# Altium project FC_Ver0.PrjPcb
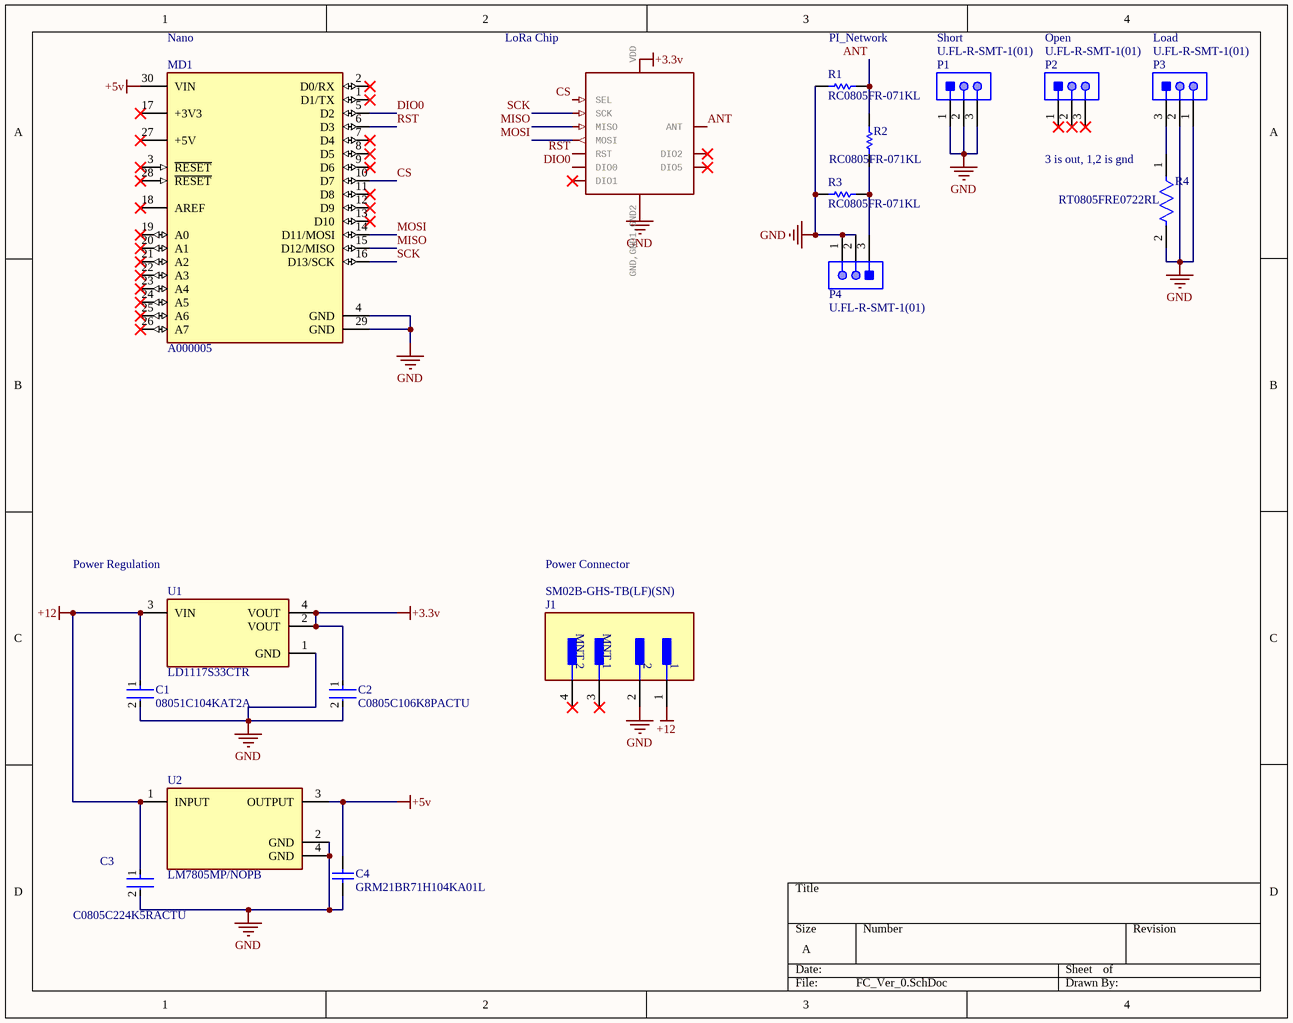
[diagram p0: FC_Ver_0.SchDoc]
1 sheet, 17 parts. Net scope: global (net labels, ports and power ports of the same name join across sheets).
Board file: FC_Ver_0.PcbDoc

## Sheet FC_Ver_0.SchDoc
size A; SheetNumber: 1; SheetTotal: 1

### Parts
1  _C2H_RFM95  [_C2H_RFM95]  (value not drawn)
C1  08051C104KAT2A  [FP-0805-L_2_01_0_2-W_1_25-IPC_B]
C2  C0805C106K8PACTU  [FP-C0805C-DG-MFG]
C3  C0805C224K5RACTU  [FP-C0805C-DN-MFG]
C4  GRM21BR71H104KA01L  [CAPC2013X135X45ML10T25]
J1  SM02B-GHS-TB(LF)(SN)  [FP-SM02B-GHS-TB_LF_SN-MFG]
MD1  A000005  [FP-A000005-MFG]
P1  U.FL-R-SMT-1(01)  [HRS-U.FL-R-SMT-3_V]
P2  U.FL-R-SMT-1(01)  [HRS-U.FL-R-SMT-3_V]
P3  U.FL-R-SMT-1(01)  [HRS-U.FL-R-SMT-3_V]
P4  U.FL-R-SMT-1(01)  [HRS-U.FL-R-SMT-3_V]
R1  RC0805FR-071KL  [RESC2013X60X35ML10T20]
R2  RC0805FR-071KL  [RESC2013X60X35ML10T20]
R3  RC0805FR-071KL  [RESC2013X60X35ML10T20]
R4  RT0805FRE0722RL  [FP-RT0805-MFG]
U1  LD1117S33CTR  [FP-SOT-223-0046067_14-MFG]
U2  LM7805MP/NOPB  [FP-DCY0004A-MFG]

### Nets
+3.3v: 1.VDD(VCC) C2.1 U1.2(VOUT) U1.4(VOUT)
+5v: C4.1 MD1.30(VIN) U2.3(OUTPUT)
+12: C1.1 C3.1 J1.1 U1.3(VIN) U2.1(INPUT)
GND: 1.GND,GND1,GND2(GND) C1.2 C2.2 C3.2 C4.2 J1.2 MD1.4(GND) MD1.29(GND) P1.1 P1.2 P1.3 P3.1 P3.2 P4.1 P4.2 R1.2 R3.1 R4.2 U1.1(GND) U2.2(GND) U2.4(GND)
ANT: 1.ANT R1.1 R2.2
CS: 1.NSS(SEL) MD1.10(D7)
DIO0: 1.DIO0 MD1.5(D2)
MISO: 1.MISO MD1.15(D12/MISO)
MOSI: 1.MOSI MD1.14(D11/MOSI)
RST: 1.RST MD1.6(D3)
SCK: 1.SCK MD1.16(D13/SCK)
NetP3_3: P3.3 R4.1
NetP4_3: P4.3 R2.1 R3.2

Not connected (* = marked no-connect by the designer): 1 DIO1* DIO2* DIO5*; J1 3(MNT_1)* 4(MNT_2)*; MD1 1(D1/TX)* 2(D0/RX)* 3(~{RESET})* 7(D4)* 8(D5)* 9(D6)* 11(D8)* 12(D9)* 13(D10)* 17(+3V3)* 18(AREF)* 19(A0)* 20(A1)* 21(A2)* 22(A3)* 23(A4)* 24(A5)* 25(A6)* 26(A7)* 27(+5V)* 28(~{RESET})*; P2 1* 2* 3*

### Notes on the sheet
- (near MD1) Nano
- (near 1) LoRa Chip
- (near R1) PI_Network
- Short
- Open
- Load
- (near R4) 3 is out, 1,2 is gnd
- (near U1) Power Regulation
- Power Connector

### Library data of the parts
1 = _C2H_RFM95: GateName_1: G$1; SymbolName_1: _C2H_RFM95; LibraryName: AmbaSat-1v1-01-NO-solar; DeviceSetName: _C2H_RFM95; Package: _C2H_RFM95
C1 = CMP-2007-04174-2: General Purpose Ceramic Capacitor, 0805, 100nF, 10%, X7R, 15%, 100V; Packaging: Tape and Reel; Min Operating Temperature: -55°C; Dielectric Material: Ceramic; Height: 1.4mm; Voltage Rating: 100V; Termination: SMD/SMT; Case Code (Imperial): 0805; Case Code (Metric): 2012; Case/Package: 0805; Construction: Flat; Radiation Hardening: No; Series: -; Dielectric: X7R; Package Quantity: 2000; Mount: Surface Mount; Capacitance: 100nF; Contact Plating: Tin; Voltage: 100V; Lead Free: Lead Free; Depth: 1.25mm; RoHS Compliant: Yes; Number of Pins: 2; Max Operating Temperature: 125°C; Length: 2.01mm; Voltage Rating (DC): 100V; Thickness: 0.055inch; REACH SVHC: No SVHC; Width: 0.049inch; Tolerance: 10%
C2 = CMP-2007-03243-2: CAP CER 10UF 10V X5R 0805; Manufacturer: Kemet; 3DS Part Number: 220-00001; Tolerance: 10%; Temperature Coefficient: 15%; Material: Ceramic; Device Class L2: Capacitors; Device Class L1: Passive Components; ComponentLink2URL: https://content.kemet.com/datasheets/KEM_C1006_X5R_SMD.pdf; Height: 1.4mm; Lead Free: Yes; Manufacturer Part Number: C0805C106K8PACTU; Digikey Description: CAP CER 10UF 10V X5R 0805; Octopart: https://octopart.com/c0805c106k8pactu-kemet-98697; Capacitance: 10uF; Value: 10uF; Temperature Range Low: -55°C; Temperature: -55°C to +85°C; Automotive: No; Mouser Description: CAP CER 10UF 10V X5R 0805; Ipc Land Pattern Name: CAPC200125X125; Temperature Range High: +85°C; Voltage: 10V; RoHS: TRUE; Device Class L3: Ceramic Capacitors; ComponentLink2Description: Datasheet; Voltage Rating: 10V; Package: C0805C-DG; Temperature Characteristic: X5R; Category: Cap
C3 = CMP-1036-04552-2: CAP CER 0.22UF 50V X7R 0805; Manufacturer: KEMET; Value: 0.22 μF; Temperature Coefficient: 30ppm/°C; Material: Ceramic; Tolerance: 0.1; ComponentLink2URL: https://content.kemet.com/datasheets/KEM_C1003_C0G_SMD.pdf; Temperature Characteristic: X7R; Device Class L3: Ceramic Capacitors; Lead Free: Yes; Temperature: -55°C to +125°C; RoHS: TRUE; Capacitance: 0.22 μF; Automotive: No; Octopart: https://octopart.com/c0805c224k5ractu-kemet-144670; Manufacturer Part Number: C0805C224K5RACTU; Temperature Range Low: -55°C; Height: 0.88mm; Device Class L1: Passive Components; Digikey Description: CAP CER 0.22UF 50V X7R 0805; ComponentLink2Description: Datasheet; Mouser Description: CAP CER 0.22UF 50V X7R 0805; Category: Cap; Ipc Land Pattern Name: CAPC200125X78; Temperature Range High: +125°C; Package: C0805C-DN; Device Class L2: Capacitors; Voltage Rating: 50 V
C4 = CMP-2100-03644-1: Chip Capacitor, 0.1 uF, +/- 10%, 50 V, -55 to 125 degC, 0805 (2012 Metric), RoHS, Tape and Reel; Manufacturer: Murata; Voltage: 50V; Capacitance: 100nF; Insulation Resistance: 10GR; Dielectric Material: Ceramic; Dielectric: X7R; Package Description: 2-Pin Surface Mount Device, Body 2 x 1.25 mm; Manufacturer URL: http://www.murata.com/; Case Code (Imperial): 0805; Datasheet URL: http://psearch.en.murata.com/capacitor/product/GRM21BR71H104KA01%23.pdf; Termination: SMD/SMT; Lead Free: LeadFree; Package Quantity: 1; Mount: SurfaceMount; REACH SVHC: Unknown; Thickness: 0.053inch; Height: 1.25mm; Case/Package: 0805; Voltage Rating: 50V; Width: 0.049inch; Case Code (Metric): 2012; Material: Ceramic; Min Operating Temperature: -55degC; RoHSCompliant: true; Datasheet Version: 42675.0; Voltage Rating (DC): 50V; Tolerance: 10%; Package Reference: 0805; Depth: 1.25mm; Length: 2mm; Max Operating Temperature: 125degC; Packaging: TapeandReel; Number of Pins: 2; Radiation Hardening: No
J1 = CMP-2000-07076-2: CONN HEADER SMD R/A 2POS 1.25MM; Voltage Rating: 50V; Number of Positions: 2; Pitch: 0.049inch; Current Rating: 1A; Connector Type: Outer Shroud Contact; Number of Rows: 1; Contact Material: Bronze; Termination: Solder; Color: Natural; Package Quantity: 2500; Mount: Surface Mount; Housing Color: Natural; Number of Contacts: 2; Packaging: Tape and Reel; Lead Free: Lead Free; Housing Material: Nylon; Orientation: Right Angle; Contact Type: Male Pin; Contact Plating: Tin; Series: GH; Fastening Type: Latch
MD1 = CMP-189986-000002-1: ARDUINO NANO ATMEGA328 EVAL BRD; Number of Bits: 8; Evaluation Kit: Yes; Operating Supply Voltage: 12V; Interface: I2C; Data Bus Width: 8b; Core Architecture: AVR; Packaging: Bulk; Length: 7inch; Package Quantity: 50; Width: 5inch; REACH SVHC: No SVHC; Weight: 0.358383oz; Series: AVR® ATmega; Height: 0.25inch
P1-P4 = CMP-2000-05153-1: Ultra Small Coaxial Connector, 6 GHz, -40 to 90 degC, 3-Pin SMD, RoHS, Bulk; Manufacturer: Hirose Electric; Connector Style: U.FL; Impedance: 50Ohm; Dielectric Material: LiquidCrystalPolymer(LCP); Minimum Quantity: UltraMiniatureCoaxial; Online Catalog: U.FLSeries; Featured Product: HiroseU.FLSeries; Frequency - Max: 6GHz; Other Names: H122041 / U.FL-R-SMT-1(01)-ND; Contact Termination: Solder; Body Material: PhosphorBronze; Connector Type: Jack,MalePin; Body Finish: Silver; Center Contact Plating: Gold; Manufacturer URL: https://www.hirose.com; Family: CoaxialConnectors(RF); Fastening Type: Snap-On; Unit PriceUSD: U.FL; Series: U.FL; Package Reference: U.FL-R-SMT; Packaging: Bulk; Standard Package: 100; Mounting Type: SurfaceMount; Quantity Available: Bulk; Housing Color: Silver; Package Description: 3-Pin Surface Mount Device, Body 2.6 x 2.6 mm; Category: Connectors,Interconnects; Operating Temperature: -40degC~90degC; Center Contact Material: PhosphorBronze; Dynamic Catalog: U.FLSeries; Datasheet URL: https://datasheet.ciiva.com/26945/getdatasheetpartid-475239-26945414.pdf; Datasheet Version: Feb-09; Shield Termination: Solder
R1-R3 = CMP-2100-03671-1: Chip Resistor, 1 KOhm, +/- 1%, 125 mW, -55 to 155 degC, 0805 (2012 Metric), RoHS, Tape and Reel; Manufacturer: Yageo; Temperature Coefficient: 100ppm/degreesC; Voltage Rating (DC): 150V; Max Power Dissipation: 125mW; Resistance: 1KOhm; Number of Pins: 2; Number of Terminations: 2; Datasheet URL: http://www.yageo.com/NewPortal/yageodocoutput?fileName=/pdf/R-Chip/PYu-RC_Group_51_RoHS_L_5.pdf; Length: 0.079inch; Package Description: 2-Pin Surface Mounted Device, Body 2 x 1.25 mm; Depth: 1.25mm; Height: 0.024inch; Military Standard: Not; Case/Package: 0805; Package Reference: 0805; RoHSCompliant: true; Lead Free: LeadFree; Packaging: TapeandReel; Package Quantity: 1; Datasheet Version: Rev. 5, 10/2016; Tolerance: 1%; Min Operating Temperature: -55degC; Voltage Rating: 150V; Composition: ThickFilm; Case Code (Imperial): 0805; Power Rating: 125mW; Width: 0.049inch; Case Code (Metric): 2012; Manufacturer URL: http://www.yageo.com/; Max Operating Temperature: 155degC; REACH SVHC: Unknown; Termination: SMD/SMT
R4 = CMP-03412-009509-1: RES SMD 22 OHM 1% 1/8W 0805; Manufacturer: Yageo; Value: 22Ω; Power Rating: 0.125W; Tolerance: 0.0001; Voltage Rating: 150V; Temperature Coefficient: 50 ppm/°C; Height: 0.6mm; ComponentLink2Description: Datasheet; Composition: Thin Film; Octopart: https://octopart.com/rt0805fre0722rl-yageo-39984181; Device Class L1: Passive Components; RoHS: TRUE; Temperature Range Low: -55°C; Temperature Range High: +155°C; Automotive: No; Lead Free: Yes; Resistance: 22Ω; Device Class L2: Resistors; Series: RT; Category: Res; Manufacturer Part Number: RT0805FRE0722RL; ComponentLink2URL: http://www.yageo.com/documents/recent/PYu-RT_1-to-0.01_RoHS_L_9.pdf; Footprint Url: http://www.yageo.com/exep/pages/download/literatures/PYu-R_Mount_10.pdf; Digikey Description: RES SMD 22 OHM 1% 1/8W 0805; Package: RT0805; Device Class L3: Chip SMD Resistors; Ipc Land Pattern Name: RESC200125X50; Temperature: -55°C to +155°C; Mouser Description: Thin Film Resistors - SMD 1/8W 22 ohm 1% 50ppm
U1 = CMP-0244-00307-2: IC REG LINEAR 3.3V 800MA SOT223; Input Bias Current: 5mA; Output Voltage Accuracy: 1%; Dropout Voltage: 1.1V; Power Dissipation: 12W; Polarity: Positive; Min Input Voltage: 5.3V; Quiescent Current: 10mA; Max Output Current: 1.3A; Output Current: 950mA; Number of Regulators: 1; Max Supply Voltage: 15V; Output Type: Fixed; Output Voltage: 3.3V; Number of Terminals: 4; Min Supply Voltage: 3.3V; Termination: SMD/SMT; Mount: Surface Mount; Max Power Dissipation: 12W; Case/Package: SOT-223; Lead Free: Lead Free; Height: 1.8mm; REACH SVHC: No SVHC; Radiation Hardening: No; Width: 3.5mm; Length: 6.5mm; Packaging: Tape and Reel; Max Input Voltage: 15V; Accuracy: 1%; Weight: 0.01lb; Contact Plating: Tin; Max Operating Temperature: 125°C; Number of Pins: 4; Max Output Voltage: 3.3V; Min Operating Temperature: -40°C; Nominal Output Voltage: 3.3V; Package Quantity: 1; Min Output Voltage: 3.3V; Number of Outputs: 1
U2 = CMP-04917-000007-1: IC REG LINEAR 5V 1.5A SOT223-4; Manufacturer: Texas Instruments; Max Supply Voltage: 30V; Max Junction Temp: +150°C; Number Of Outputs: 1; Standoff Height: 0.02mm; Dropout Voltage: 2V; Accuracy Percentage: 3%; Nominal Supply Current: 8mA; Output Type: Fixed; Min Supply Voltage: 7.5V; Lead Free: Yes; Device Class L1: Integrated Circuits (ICs); Manufacturer Part Number: LM7805MP/NOPB; Package: DCY0004A; ComponentLink2Description: Datasheet; Temperature Range Low: 0°C; ComponentLink2URL: http://www.ti.com/lit/ds/symlink/lm7800.pdf; Height: 1.8mm; Temperature: 0°C to +125°C; Category: IC; Device Class L3: Voltage Regulators - Linear; Octopart: https://octopart.com/lm7805mp%2Fnopb-texas+instruments-74629991; Device Class L2: Power Management ICs; Output Voltage: 5V; RoHS: TRUE; Temperature Range High: +125°C; Automotive: No; Digikey Description: IC REG LINEAR 5V 1.5A SOT223-4; Output Current: 1.5A